# Altium schematic sheet Filter Capacitors - Port A.SchDoc: PORT A Filter Capacitors
size A4; DocumentNumber: 37; SheetNumber: 37; SheetTotal: 54
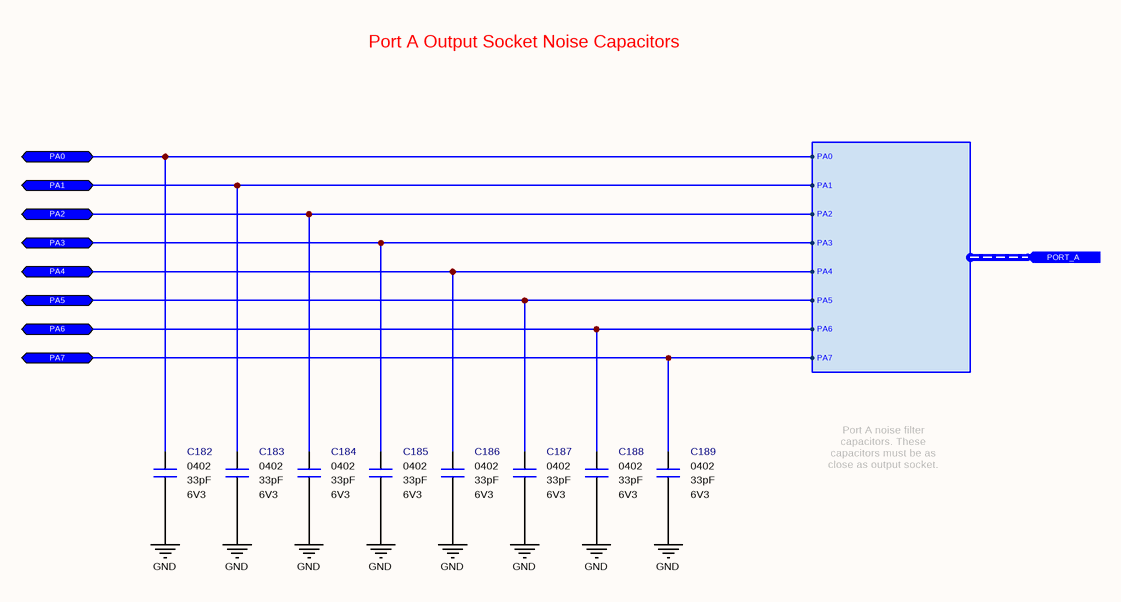
[diagram p0: Filter Capacitors - Port A.SchDoc]

## Parts
C182  value 33pF  Case: 0402  Voltage: 6V3  [CAPACITOR_0402]  (hidden comment: Multilayer Ceramic Capacitor)
C183  value 33pF  Case: 0402  Voltage: 6V3  [CAPACITOR_0402]  (hidden comment: Multilayer Ceramic Capacitor)
C184  value 33pF  Case: 0402  Voltage: 6V3  [CAPACITOR_0402]  (hidden comment: Multilayer Ceramic Capacitor)
C185  value 33pF  Case: 0402  Voltage: 6V3  [CAPACITOR_0402]  (hidden comment: Multilayer Ceramic Capacitor)
C186  value 33pF  Case: 0402  Voltage: 6V3  [CAPACITOR_0402]  (hidden comment: Multilayer Ceramic Capacitor)
C187  value 33pF  Case: 0402  Voltage: 6V3  [CAPACITOR_0402]  (hidden comment: Multilayer Ceramic Capacitor)
C188  value 33pF  Case: 0402  Voltage: 6V3  [CAPACITOR_0402]  (hidden comment: Multilayer Ceramic Capacitor)
C189  value 33pF  Case: 0402  Voltage: 6V3  [CAPACITOR_0402]  (hidden comment: Multilayer Ceramic Capacitor)

## Ports
PA0 (bidir), PA1 (bidir), PA2 (bidir), PA3 (bidir), PA4 (bidir), PA5 (bidir), PA6 (bidir), PA7 (bidir), PORT_A (in, harness PORT_A)

## Harnesses
PORT_A: PA0, PA1, PA2, PA3, PA4, PA5, PA7, PA6

## Nets
GND: C182.1 C183.1 C184.1 C185.1 C186.1 C187.1 C188.1 C189.1
PA0: C182.2 ; port PA0, port PORT_A.PA0
PA1: C183.2 ; port PA1, port PORT_A.PA1
PA2: C184.2 ; port PA2, port PORT_A.PA2
PA3: C185.2 ; port PA3, port PORT_A.PA3
PA4: C186.2 ; port PA4, port PORT_A.PA4
PA5: C187.2 ; port PA5, port PORT_A.PA5
PA6: C188.2 ; port PA6, port PORT_A.PA6
PA7: C189.2 ; port PA7, port PORT_A.PA7

## Notes on the sheet
- Port A Output Socket Noise Capacitors
- Port A noise filter capacitors. These capacitors must be as close as output socket.
- Engineer
- All Rights are reserved to Customer and Engineer. [2021]
- Size:
- Date:
- A4
- Project :
- Time:
- Sheet
- of
- Customer
- Product ID
- Module ID
- Version
- File:
- Revision

## Library data of the parts
C182-C189 = Capacitor - 33pF [0402-6V3]: Capacitor - 33pF [0402] (Ceramic); Manufacturer Name: Kemet; Manufacturer Part Number: C0402C330J9RACAUTO; Dielectric: X7R; Tolerance: 10%; Height: 0.5mm; Maximum Operating Temperature: +125; Minimum Operating Temperature: -55; ROHS: Yes; ComponentLink1Description: DataSheet; ComponentLink1URL: https://api.kemet.com/component-edge/download/datasheet/C0402C330J9RACAUTO.pdf; ComponentLink2Description: Mouser; ComponentLink2URL: https://www.mouser.com/Search/Refine.aspx?Keyword=80-C0402C330J9RAUTO; Supplier 1: Mouser; Supplier Part Number 1: 80-C0402C330J9RAUTO; Mouser Part Number: 80-C0402C330J9RAUTO